# Altium schematic sheet Central PCB Schematic.SchDoc
size A; SheetNumber: 1; SheetTotal: 1
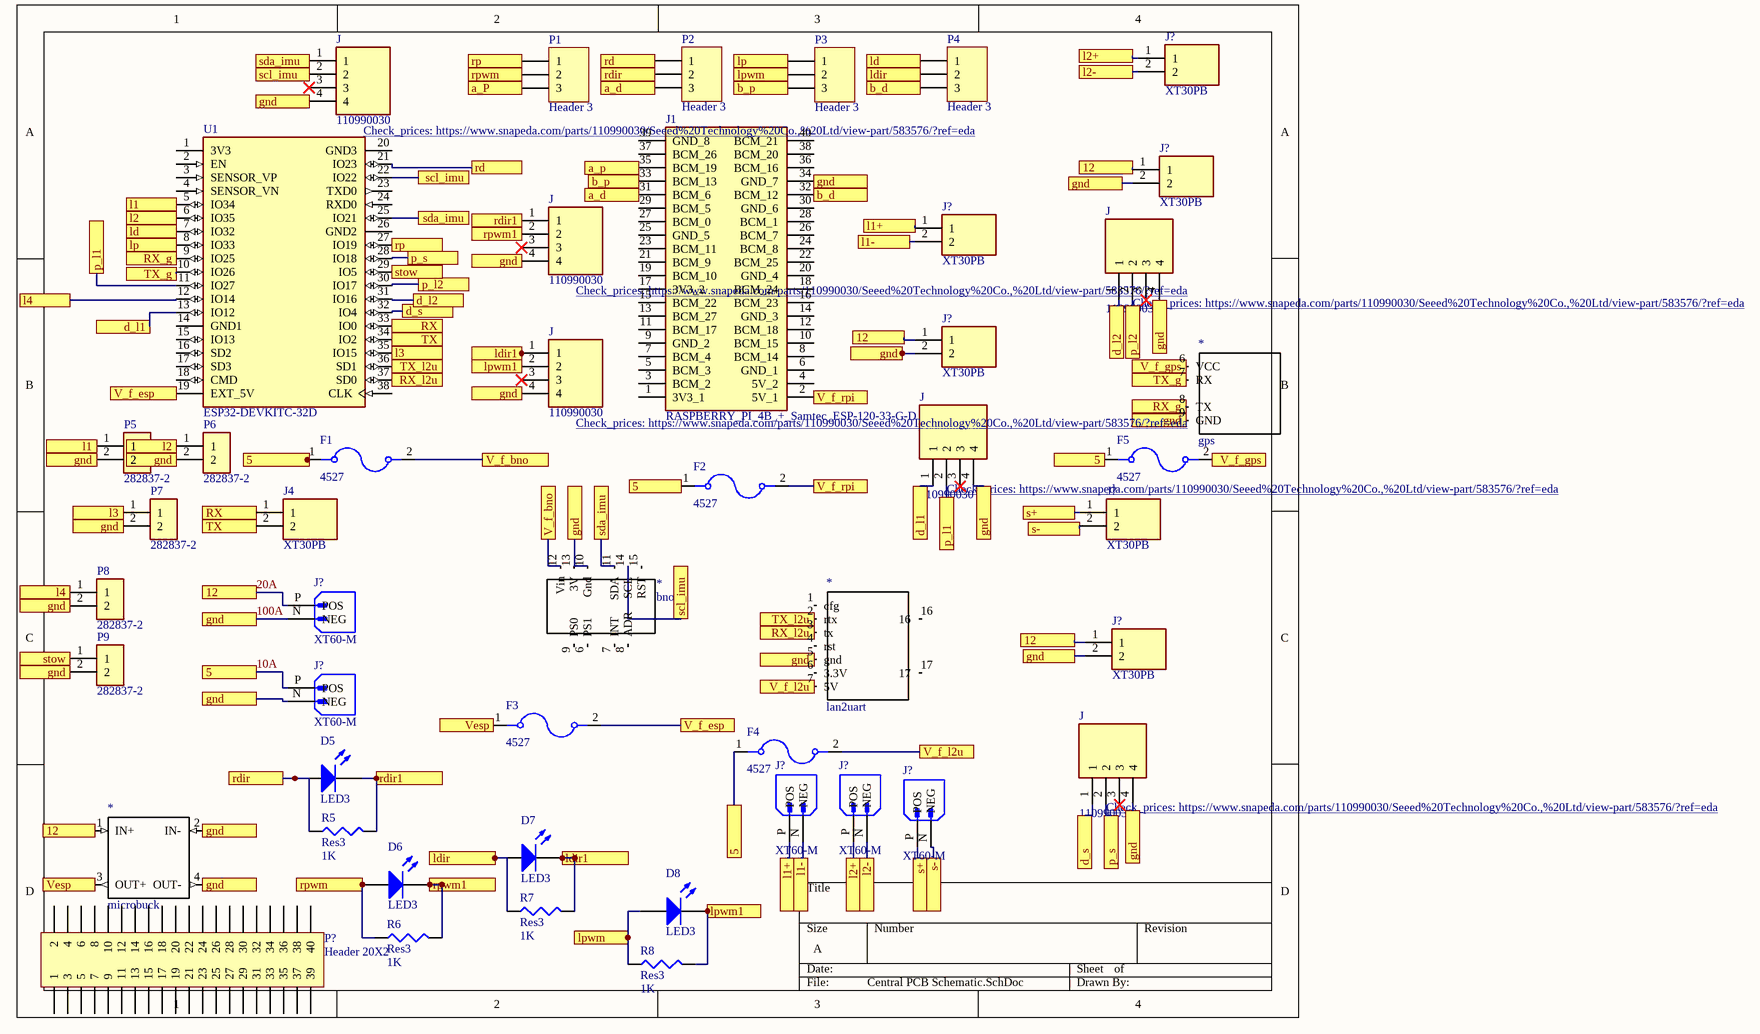
[diagram p0: Central PCB Schematic.SchDoc]

## Parts
(Parts that share a designator on the sheet are numbered #1, #2 ... from top to bottom, then left to right.)
*#1  gps  [gps]
*#2  bno  [BNO]
*#3  lan2uart  [lan2uart]
*#4  microbuck  [Micro buck]
D5  LED3  [3.5X2.8X1.9]
D6  LED3  [3.5X2.8X1.9]
D7  LED3  [3.5X2.8X1.9]
D8  LED3  [3.5X2.8X1.9]
F1  4527  [FUSE_4527]
F2  4527  [FUSE_4527]
F3  4527  [FUSE_4527]
F4  4527  [FUSE_4527]
F5  4527  [FUSE_4527]
J1  RASPBERRY_PI_4B_+_Samtec_ESP-120-33-G-D  [RASPBERRYPI4B4GB]
J4  XT30PB  [XT30PB]
J#1  110990030  [SEEED_110990030]
J#2  110990030  [SEEED_110990030]
J#3  110990030  [SEEED_110990030]
J#4  110990030  [SEEED_110990030]
J#5  110990030  [SEEED_110990030]
J#6  110990030  [SEEED_110990030]
J?#1  XT30PB  [XT30PB]
J?#2  XT30PB  [XT30PB]
J?#3  XT30PB  [XT30PB]
J?#4  XT30PB  [XT30PB]
J?#5  XT30PB  [XT30PB]
J?#6  XT60-M  [AMASS_XT60-M]
J?#7  XT30PB  [XT30PB]
J?#8  XT60-M  [AMASS_XT60-M]
J?#9  XT60-M  [AMASS_XT60-M]
J?#10  XT60-M  [AMASS_XT60-M]
J?#11  XT60-M  [AMASS_XT60-M]
P1  Header 3  [HDR1X3]
P2  Header 3  [HDR1X3]
P3  Header 3  [HDR1X3]
P4  Header 3  [HDR1X3]
P5  282837-2  [TE_282837-2]
P6  282837-2  [TE_282837-2]
P7  282837-2  [TE_282837-2]
P8  282837-2  [TE_282837-2]
P9  282837-2  [TE_282837-2]
P?  Header 20X2  [HDR2X20]
R5  Res3  value 1K  [14-1210]
R6  Res3  value 1K  [14-1210]
R7  Res3  value 1K  [14-1210]
R8  Res3  value 1K  [14-1210]
U1  ESP32-DEVKITC-32D  [MODULE_ESP32-DEVKITC-32D]

## Ports
5, 12, a_d, a_p, a_P, b_d, b_p, d_l1, d_l2, d_s, gnd, l1, l1+, l1-, l2, l2+, l2-, l3, l4, ld, ldir, ldir1, lp, lpwm, lpwm1, p_l1, p_l2, p_s, Port, rd, rdir, rdir1, rp, rpwm, rpwm1, RX, RX_g, RX_l2u, s+, s-, scl_imu, sda_imu, stow, TX, TX_g, TX_l2u, V_f_bno, V_f_esp, V_f_gps, V_f_l2u, V_f_rpi, Vesp

## Nets
10A: F1.1 F2.1 F4.1 F5.1 J?#8.P(POS) ; port 5
20A: *#4.1(IN+) J?#2.1 J?#4.1 J?#6.P(POS) J?#7.1 ; port 12
100A: *#1.9(GND) *#2.10(Gnd) *#3.5(gnd) *#4.2(IN-) *#4.4(OUT-) J1.34(GND_7) J#1.4 J#2.4 J#3.4 J#4.4 J#5.4 J#6.4 J?#2.2 J?#4.2 J?#6.N(NEG) J?#7.2 J?#8.N(NEG) P5.2 P6.2 P7.2 P8.2 P9.2 ; port gnd
a_d: J1.31(BCM_6) P2.3 ; port a_d
a_p: J1.35(BCM_19) P1.3 ; port a_p, port a_P
b_d: J1.32(BCM_12) P4.3 ; port b_d
b_p: J1.33(BCM_13) P3.3 ; port b_p
d_l1: J#5.1 U1.13(IO12) ; port d_l1
d_l2: J#3.1 U1.31(IO16) ; port d_l2
d_s: J#6.1 U1.32(IO4) ; port d_s
l1: P5.1 U1.5(IO34) ; port l1
l1+: J?#3.1 J?#9.P(POS) ; port l1+
l1-: J?#3.2 J?#9.N(NEG) ; port l1-
l2: P6.1 U1.6(IO35) ; port l2
l2+: J?#1.1 J?#10.P(POS) ; port l2+
l2-: J?#1.2 J?#10.N(NEG) ; port l2-
l3: P7.1 U1.35(IO15) ; port l3
l4: P8.1 U1.12(IO14) ; port l4
ld: P4.1 U1.7(IO32) ; port ld
ldir: D7.1(A) P4.2 R7.1 ; port ldir
ldir1: D7.2(K) J#4.1 R7.2 ; port Port, port ldir1
lp: P3.1 U1.8(IO33) ; port lp
lpwm: D8.1(A) P3.2 R8.1 ; port lpwm
lpwm1: D8.2(K) J#4.2 R8.2 ; port lpwm1
p_l1: J#5.2 U1.11(IO27) ; port p_l1
p_l2: J#3.2 U1.30(IO17) ; port p_l2
p_s: J#6.2 U1.28(IO18) ; port p_s
rd: P2.1 U1.21(IO23) ; port rd
rdir: D5.1(A) P2.2 R5.1 ; port rdir
rdir1: D5.2(K) J#2.1 R5.2 ; port rdir1
rp: P1.1 U1.27(IO19) ; port rp
rpwm: D6.1(A) P1.2 R6.1 ; port rpwm
rpwm1: D6.2(K) J#2.2 R6.2 ; port rpwm1
RX: J4.1 U1.33(IO0) ; port RX
RX_g: *#1.8(TX) U1.9(IO25) ; port RX_g
RX_l2u: *#3.3(tx) U1.37(SD0) ; port RX_l2u
s+: J?#5.1 J?#11.P(POS) ; port s+
s-: J?#5.2 J?#11.N(NEG) ; port s-
scl_imu: *#2.14(SCL) J#1.2 U1.22(IO22) ; port scl_imu
sda_imu: *#2.11(SDA) J#1.1 U1.25(IO21) ; port sda_imu
stow: P9.1 U1.29(IO5) ; port stow
TX: J4.2 U1.34(IO2) ; port TX
TX_g: *#1.7(RX) U1.10(IO26) ; port TX_g
TX_l2u: *#3.2(rtx) U1.36(SD1) ; port TX_l2u
V_f_bno: *#2.12(Vin) F1.2 ; port V_f_bno
V_f_esp: F3.2 U1.19(EXT_5V) ; port V_f_esp
V_f_gps: *#1.6(VCC) F5.2 ; port V_f_gps
V_f_l2u: *#3.7(5V) F4.2 ; port V_f_l2u
V_f_rpi: F2.2 J1.2(5V_1) ; port V_f_rpi
Vesp: *#4.3(OUT+) F3.1 ; port Vesp

Not connected (* = marked no-connect by the designer): *#2 6(PS1) 7(INT) 8(ADR) 9(PS0) 13(3V) 15(RST); *#3 1(cfg) 4(rst) 6(3.3V) 16 17; J1 1(3V3_1) 3(BCM_2) 4(5V_2) 5(BCM_3) 6(GND_1) 7(BCM_4) 8(BCM_14) 9(GND_2) 10(BCM_15) 11(BCM_17) 12(BCM_18) 13(BCM_27) 14(GND_3) 15(BCM_22) 16(BCM_23) 17(3V3_2) 18(BCM_24) 19(BCM_10) 20(GND_4) 21(BCM_9) 22(BCM_25) 23(BCM_11) 24(BCM_8) 25(GND_5) 26(BCM_7) 27(BCM_0) 28(BCM_1) 29(BCM_5) 30(GND_6) 36(BCM_16) 37(BCM_26) 38(BCM_20) 39(GND_8) 40(BCM_21); J#1 3*; J#2 3*; J#3 3*; J#4 3*; J#5 3*; J#6 3*; P? 1 2 3 4 5 6 7 8 9 10 11 12 13 14 15 16 17 18 19 20 21 22 23 24 25 26 27 28 29 30 31 32 33 34 35 36 37 38 39 40; U1 1(3V3) 2(EN) 3(SENSOR_VP) 4(SENSOR_VN) 14(GND1) 15(IO13) 16(SD2) 17(SD3) 18(CMD) 20(GND3) 23(TXD0) 24(RXD0) 26(GND2) 38(CLK)

## Library data of the parts
*#1 = gps: pin to pad: 6>39 7>40 8>41 9>42
D5-D8 = LED3: Typical BLUE SiC LED; Published: 8-Jun-2000; LatestRevisionDate: 17-Dec-2003; LatestRevisionNote: PCB Footprint replaced.; DatasheetVersion: 16-Apr-2002; PackageVersion: 16-Apr-2002; PackageReference: 3.5X2.8X1.9; Publisher: Altium Limited; PackageDescription: SM LED; 2 C-Bend Leads; Body 3.5 x 2.8 x 1.9 mm, inc leads (LxWxH typ)
F1-F5 = 4527: Fuseholder; 5 A; 250 V; Nylon; Base only; Brass, Tin Plate (Contact); Value: *; MP: 4527; Package: None; Availability: Unavailable; Price: None
J1 = RASPBERRY_PI_4B_+_Samtec_ESP-120-33-G-D: Connector; Manufacturer_Name: RASPBERRY-PI; Manufacturer_Part_Number: RASPBERRY PI 4B + Samtec ESP-120-33-G-D; Datasheet Link: https://www.raspberrypi.org/documentation/hardware/raspberrypi/mechanical/rpi_MECH_4b_4p0.pdf; Height: 24.3mm
J4 J?#1-J?#5 J?#7 = XT30PB: Connector; Manufacturer_Name: Amass; Datasheet Link: https://www.tme.eu/Document/4acc913878197f8c2e30d4b8cdc47230/XT30UPB%20SPEC.pdf; Height: 10.7mm; Manufacturer_Part_Number: XT30PB
J#1-J#6 = 110990030: GROVE 2MM 4PIN VERT CONN 10PCS; MF: Seeed Technology; Arrow_Electronics-Purchase-URL: https://snapeda.com/shop?store=Arrow+Electronics&id=583576; Availability: Good; Package: None; Price: None; Mouser-Purchase-URL: https://snapeda.com/shop?store=Mouser&id=583576; MP: 110990030; SnapEDA_Link: https://www.snapeda.com/parts/110990030/Seeed%20Technology%20Co.,%20Ltd/view-part/583576/?ref=snap; Value: *; Check_prices: https://www.snapeda.com/parts/110990030/Seeed%20Technology%20Co.,%20Ltd/view-part/583576/?ref=eda
J?#6 J?#8-J?#11 = XT60-M: Plug; DC supply; XT60; male; PIN: 2; for cable; soldered; 30A; 500V; MF: AMASS; Package: Package; Availability: Not in stock; SnapEDA_Link: https://www.snapeda.com/parts/XT60-M/AMASS/view-part/?ref=snap; Check_prices: https://www.snapeda.com/parts/XT60-M/AMASS/view-part/?ref=eda; MP: XT60-M; Price: None; Value: *
P1-P4 = Header 3: Header, 3-Pin; LatestRevisionDate: 17-Jul-2002; LatestRevisionNote: Re-released for DXP Platform.; Publisher: Altium Limited
P5-P9 = 282837-2: TERM BLOCK 5.08MM 2POS SIDE ENTY; Value: *; Availability: Unavailable; Price: None; MP: 282837-2; Package: None
P? = Header 20X2: Header, 20-Pin, Dual row; LatestRevisionDate: 17-Jul-2002; LatestRevisionNote: Re-released for DXP Platform.; Publisher: Altium Limited
R5-R8 = Res3: Resistor; Published: 8-Jun-2000; LatestRevisionDate: 29-May-2009; LatestRevisionNote: IPC-7351 Footprint Added.; PackageReference: J1-0603; Publisher: Altium Limited; PackageDescription: Chip Resistor
U1 = ESP32-DEVKITC-32D: Eval Board For Esp-Wroom-32; Package: None; Availability: Unavailable; Value: *; MP: ESP32-DEVKITC-32D; Price: None